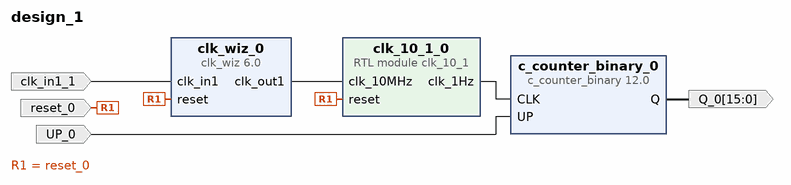
[diagram p0: block diagram of the top level]
# Vivado block design design_1, xc7s50csga324-1, Vivado 2022.2
create_bd_design design_1

create_bd_port -dir I -type rst reset_0
set_property -dict {CONFIG.POLARITY ACTIVE_HIGH} [get_bd_ports reset_0]
create_bd_port -dir I -type clk clk_in1_1
create_bd_port -dir O -from 15 -to 0 -type data Q_0
create_bd_port -dir I -type data UP_0

create_bd_cell -type ip -vlnv xilinx.com:ip:clk_wiz:6.0 clk_wiz_0
set_property -dict {CONFIG.USE_LOCKED false} [get_bd_cells clk_wiz_0]
create_bd_cell -type module -reference clk_10_1 clk_10_1_0
create_bd_cell -type ip -vlnv xilinx.com:ip:c_counter_binary:12.0 c_counter_binary_0
set_property -dict {CONFIG.Count_Mode UPDOWN CONFIG.Restrict_Count false} [get_bd_cells c_counter_binary_0]

# ---- connections ----

connect_bd_net -net UP_0_1 [get_bd_ports UP_0] [get_bd_pins c_counter_binary_0/UP]
connect_bd_net [get_bd_pins c_counter_binary_0/Q] [get_bd_ports Q_0]
connect_bd_net [get_bd_pins clk_10_1_0/clk_1Hz] [get_bd_pins c_counter_binary_0/CLK]
connect_bd_net -net clk_in1_1_1 [get_bd_ports clk_in1_1] [get_bd_pins clk_wiz_0/clk_in1]
connect_bd_net [get_bd_pins clk_wiz_0/clk_out1] [get_bd_pins clk_10_1_0/clk_10MHz]
connect_bd_net -net reset_0_1 [get_bd_ports reset_0] [get_bd_pins clk_wiz_0/reset] [get_bd_pins clk_10_1_0/reset]

validate_bd_design
save_bd_design
